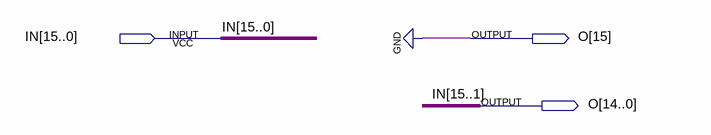
[diagram p0: schematic sheet]
// Quartus schematic SHIFTER1.bdf as structural Verilog: 0 symbols, 3 pins
module SHIFTER1 (
  input  [15:0] IN,
  output [15:0] O
);


  assign O = {1'b0, IN[15:1]};
endmodule
